# Altium project OVBaseBoardVer2.0.PrjPcb
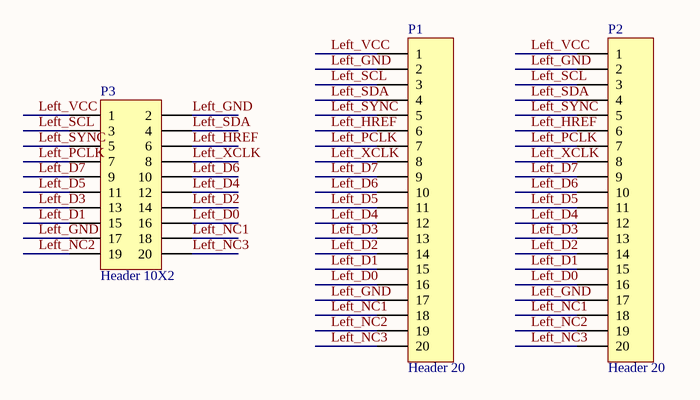
[diagram p0: Sheet1.SchDoc]
1 sheet, 3 parts. Net scope: global (net labels, ports and power ports of the same name join across sheets).
Board files: PCB3.PcbDoc, PCB1.PcbDoc

## Sheet Sheet1.SchDoc
size A4

### Parts
P1  Header 20  [FPC20Pin]
P2  Header 20  [FPC20Pin]
P3  Header 10X2  [HDR2X10]

### Nets
Left_D0: P1.16 P2.16 P3.16
Left_D1: P1.15 P2.15 P3.15
Left_D2: P1.14 P2.14 P3.14
Left_D3: P1.13 P2.13 P3.13
Left_D4: P1.12 P2.12 P3.12
Left_D5: P1.11 P2.11 P3.11
Left_D6: P1.10 P2.10 P3.10
Left_D7: P1.9 P2.9 P3.9
Left_GND: P1.2 P1.17 P2.2 P2.17 P3.2 P3.17
Left_HREF: P1.6 P2.6 P3.6
Left_NC1: P1.18 P2.18 P3.18
Left_NC2: P1.19 P2.19 P3.19
Left_NC3: P1.20 P2.20 P3.20
Left_PCLK: P1.7 P2.7 P3.7
Left_SCL: P1.3 P2.3 P3.3
Left_SDA: P1.4 P2.4 P3.4
Left_SYNC: P1.5 P2.5 P3.5
Left_VCC: P1.1 P2.1 P3.1
Left_XCLK: P1.8 P2.8 P3.8

### Library data of the parts
P1 P2 = Header 20: Header, 20-Pin; LatestRevisionDate: 17-Jul-2002; LatestRevisionNote: Re-released for DXP Platform.; Publisher: Altium Limited
P3 = Header 10X2: Header, 10-Pin, Dual row; LatestRevisionDate: 17-Jul-2002; LatestRevisionNote: Re-released for DXP Platform.; Publisher: Altium Limited